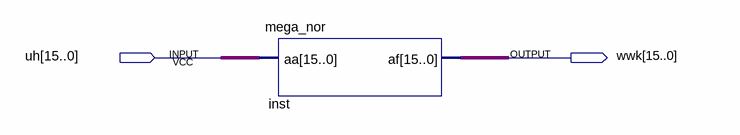
[diagram p0: schematic sheet]
// Quartus schematic Block2.bdf as structural Verilog: 1 symbols, 2 pins
module Block2 (
  input  [15:0] uh,
  output [15:0] wwk
);

  mega_nor inst (.aa(uh), .af(wwk));
endmodule
